# EAGLE schematic MIDI_Shield (EAGLE 6.5.0)
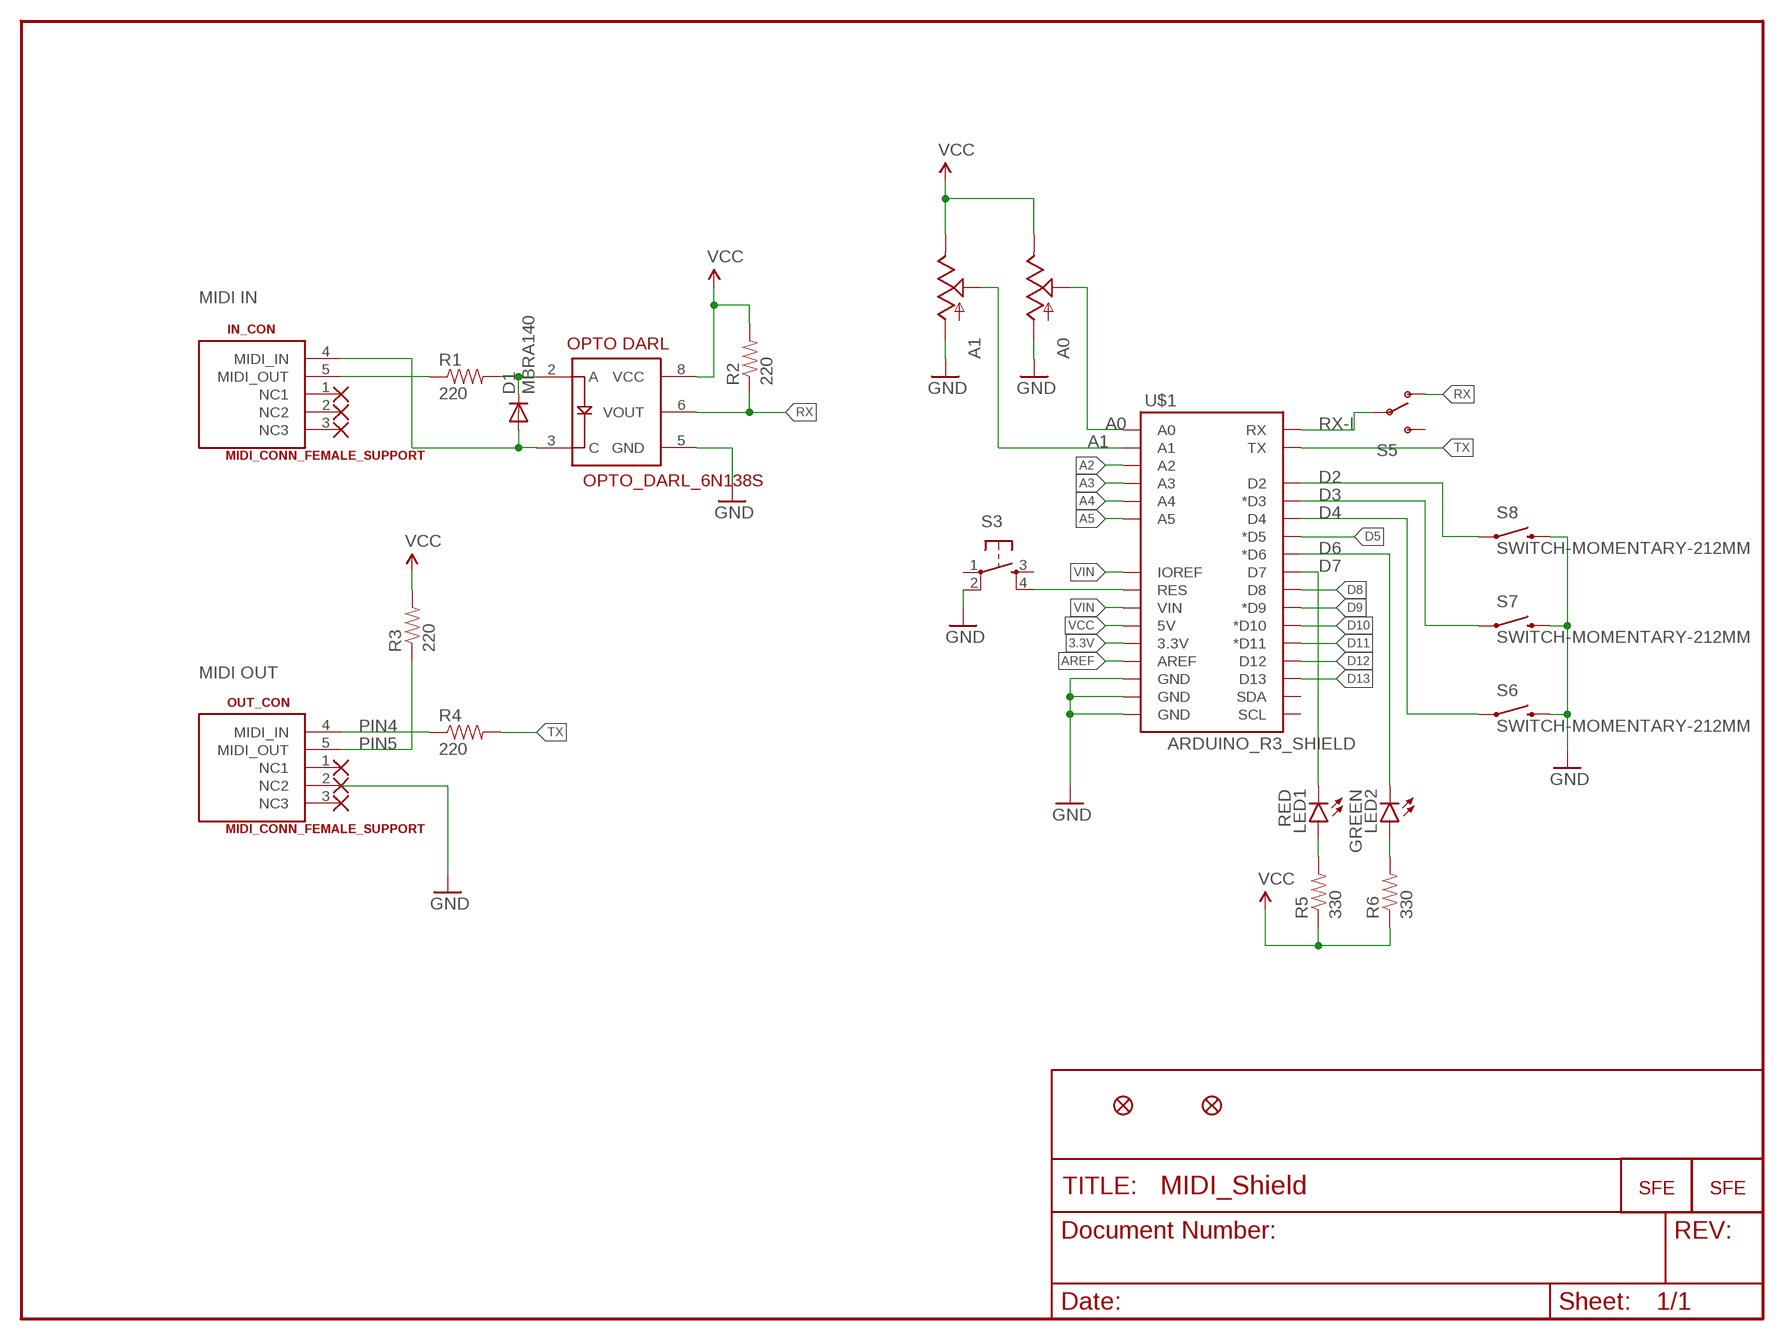
[diagram p0: schematic, sheet 1]

## Parts
A0  POT  [ALPS_POT]
A1  POT  [ALPS_POT]
D1  MBRA140  DIODESMA  [SMA-DIODE]
IN_CON  MIDI_CONN_FEMALE_SUPPORT  [DIN_5_FEMALE_SUPPORT]
JP1  FIDUCIALUFIDUCIAL  [MICRO-FIDUCIAL]
JP2  FIDUCIALUFIDUCIAL  [MICRO-FIDUCIAL]
JP3  LOGO-SFENEW  [SFE-NEW-WEBLOGO]
JP4  LOGO-SFESK  [SFE-LOGO-FLAME]
LED1  RED  LED-RED0603  [LED-0603]
LED2  GREEN  LED-GREEN0603  [LED-0603]
OUT_CON  MIDI_CONN_FEMALE_SUPPORT  [DIN_5_FEMALE_SUPPORT]
R1  220  220KOHM1/10W1%(0603)  [0603-RES]
R2  220  220KOHM1/10W1%(0603)  [0603-RES]
R3  220  220KOHM1/10W1%(0603)  [0603-RES]
R4  220  220KOHM1/10W1%(0603)  [0603-RES]
R5  330  330OHM1/10W1%(0603)  [0603-RES]
R6  330  330OHM1/10W1%(0603)  [0603-RES]
S3  TAC_SWITCHSMD  [TACTILE_SWITCH_SMD]
S5  SWITCH-SPSTSMD  [AYZ0202]
S6  SWITCH-MOMENTARY-212MM  [TACTILE-PTH-12MM]
S7  SWITCH-MOMENTARY-212MM  [TACTILE-PTH-12MM]
S8  SWITCH-MOMENTARY-212MM  [TACTILE-PTH-12MM]
U$1  ARDUINO_R3_SHIELD  [UNO_R3_SHIELD]
U$6  OPTO_DARL_6N138S  [8-SMD]

## Nets
3.3V: U$1.3.3V
56: D1.C R1.2 U$6.2(A)
1235: OUT_CON.5(MIDI_OUT) R3.1
A0: A0.P$2(S) U$1.A0
A1: A1.P$2(S) U$1.A1
A2: U$1.A2
A3: U$1.A3
A4: U$1.A4
A5: U$1.A5
AREF: U$1.AREF
D2: S8.1 U$1.D2
D3: S7.1 U$1.D3(*D3)
D4: S6.1 U$1.D4
D5: U$1.D5(*D5)
D6: LED2.C U$1.D6(*D6)
D7: LED1.C U$1.D7
D8: U$1.D8
D9: U$1.D9(*D9)
D10: U$1.D10(*D10)
D11: U$1.D11(*D11)
D12: U$1.D12
D13: U$1.D13
GND: A0.P$3(A) A1.P$3(A) OUT_CON.2(NC2) S3.2 S6.3 S7.3 S8.3 U$1.GND@0(GND) U$1.GND@1(GND) U$1.GND@2(GND) U$6.5(GND)
N$8: OUT_CON.4(MIDI_IN) R4.1
N$9: LED1.A R5.2
N$10: LED2.A R6.2
N$13: IN_CON.5(MIDI_OUT) R1.1
PIN5: D1.A IN_CON.4(MIDI_IN) U$6.3(C)
RX: R2.1 S5.1(O) U$6.6(VOUT)
RX-I: S5.2(P) U$1.RX
TX: R4.2 U$1.TX
VCC: A0.P$1(E) A1.P$1(E) R2.2 R3.2 R5.1 R6.1 S3.4 U$1.5V U$1.RES U$6.8(VCC)
VIN: U$1.IOREF U$1.VIN
Unconnected: IN_CON.1(NC1) IN_CON.2(NC2) IN_CON.3(NC3) OUT_CON.1(NC1) OUT_CON.3(NC3) S3.1 S3.3 S5.3(S) U$1.SCL U$1.SDA

## Notes on the sheet
- MIDI IN
- MIDI OUT
- PIN4
- PIN5

## Library data of the parts
A0 A1 = SparkFun:POT
D1 = SparkFun:DIODE: Diode These are standard reverse protection diodes and small signal diodes. SMA package can handle up to about 1A. SOD-323 can handle about 200mA. What the SOD-323 package when ordering, there are some mfgs out there that are 5-pin packages.
IN_CON OUT_CON = SparkFun:MIDI_CONN_FEMALE_SUPPORT
JP1 JP2 = SparkFun:FIDUCIAL: Fiducial Alignment Points Various fiducial points for machine vision alignment.
JP3 JP4 = SparkFun:LOGO-SFE: Spark Fun Electronics PCB Logo This is the standard Spark Fun Electronics PCB logo.
LED1 = SparkFun-LED:LED-RED: Assorted Red LEDs LilyPad 1206- DIO-09912 1206- DIO-00809 0603- DIO-00819; PROD_ID: DIO-00819
LED2 = SparkFun-LED:LED-GREEN: Various green LEDs Green LEDs used in SFE Production 0603- DIO-00821 LARGE- DIO-00862 LILYPAD- DIO-09910; PROD_ID: DIO-00821
R1-R4 = SparkFun-Resistors:220KOHM1/10W1%(0603): RES-08969; PROD_ID: RES-08969; VALUE: 220k
R5 R6 = SparkFun-Resistors:330OHM1/10W1%(0603): RES-00818; PROD_ID: RES-00818
S3 = SparkFun:TAC_SWITCH: Momentary Switch Button commonly used for reset or general input. Spark Fun Electronics SKU : COM-00097
S5 = SparkFun:SWITCH-SPST: SPST Switch Simple slide switch. Spark Fun Electronics SKU : COM-00102
S6-S8 = SparkFun:SWITCH-MOMENTARY-2
U$1 = SparkFun-Boards:ARDUINO_R3_SHIELD: Shield form compatible with the Arduino Uno R3.
U$6 = SparkFun:OPTO_DARL_6N138S